# EAGLE design Enclosure 85x58 WS (EAGLE 9.6.2)
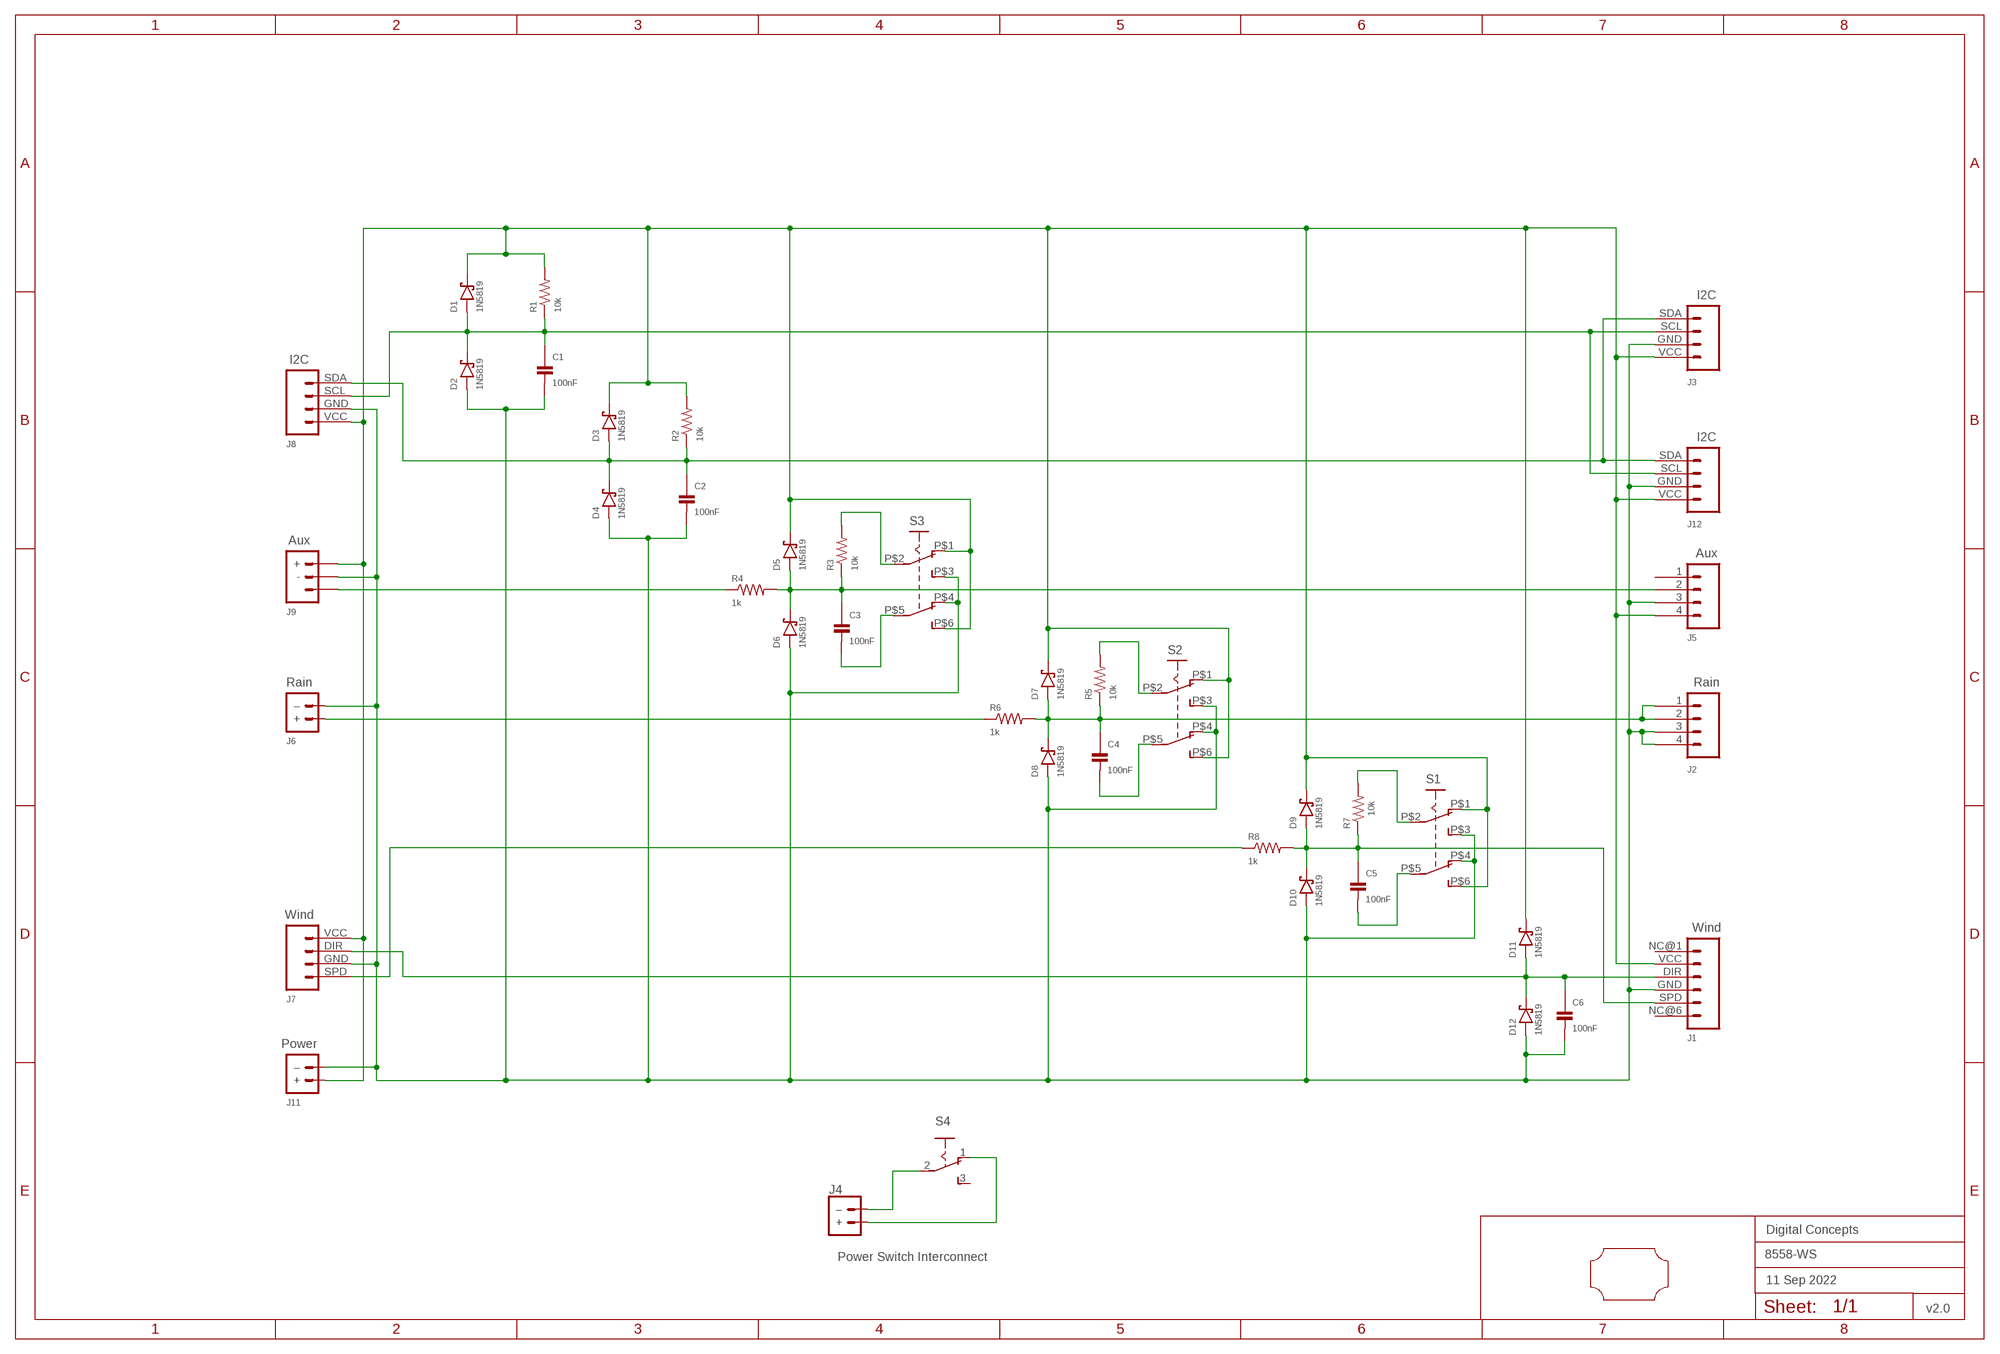
[diagram p0: schematic, sheet 1]
FRAME2 (A3L-LOC): DATE: 11 Sep 2022; OWNER: Digital Concepts; TITLE: 8558-WS; VERSION: v2.0

## Parts
C1  100nF  CAPACITOR-0805-VIA-2  [C0805-VIA-2]
C2  100nF  CAPACITOR-0805-VIA-2  [C0805-VIA-2]
C3  100nF  CAPACITOR-0805  [C0805]
C4  100nF  CAPACITOR-0805  [C0805]
C5  100nF  CAPACITOR-0805  [C0805]
C6  100nF  CAPACITOR-0805-VIA-2  [C0805-VIA-2]
D1  1N5819  DIODE-SCHOTTKY-1N5819  [SOD-123]
D2  1N5819  DIODE-SCHOTTKY-1N5819-VIA-A  [SOD-123-VIA-A]
D3  1N5819  DIODE-SCHOTTKY-1N5819  [SOD-123]
D4  1N5819  DIODE-SCHOTTKY-1N5819-VIA-A  [SOD-123-VIA-A]
D5  1N5819  DIODE-SCHOTTKY-1N5819  [SOD-123]
D6  1N5819  DIODE-SCHOTTKY-1N5819-VIA-A  [SOD-123-VIA-A]
D7  1N5819  DIODE-SCHOTTKY-1N5819  [SOD-123]
D8  1N5819  DIODE-SCHOTTKY-1N5819-VIA-A  [SOD-123-VIA-A]
D9  1N5819  DIODE-SCHOTTKY-1N5819  [SOD-123]
D10  1N5819  DIODE-SCHOTTKY-1N5819-VIA-A  [SOD-123-VIA-A]
D11  1N5819  DIODE-SCHOTTKY-1N5819  [SOD-123]
D12  1N5819  DIODE-SCHOTTKY-1N5819-VIA-A  [SOD-123-VIA-A]
J1  Wind  RJ11-6P6C-VERTICAL-WIND  [RJ11-6-VERTICAL-WIND]
J2  Rain  RJ11-6P4C-VERTICAL  [RJ11-4-VERTICAL]
J3  I2C  RJ11-6P4C-VERTICAL-I2C  [RJ11-4-VERTICAL-I2C]
J4  JST-PH2.0-2-HORIZONTALJST-PTH-2  [JST-PH2.0-2-HORIZONTAL]
J5  Aux  RJ11-6P4C-VERTICAL  [RJ11-4-VERTICAL]
J6  Rain  JST-PH2.0-2-DUALJST-PTH-2  [JST-PH2.0-2-DUAL-POWER]
J7  Wind  JST-PH2.0-4-DUAL-WIND  [JST-PH2.0-4-DUAL-WIND]
J8  I2C  JST-PH2.0-4-DUAL-I2C  [JST-PH2.0-4-DUAL-I2C]
J9  Aux  JST-PH2.0-3-DUAL  [JST-PH2.0-3-DUAL]
J11  Power  JST-PH2.0-2-DUALJST-PTH-2  [JST-PH2.0-2-DUAL-POWER]
J12  I2C  HEADER-1X4-I2C  [CONN_04-I2C]
R1  10k  RESISTOR-VIA-1  [R0805-VIA-1]
R2  10k  RESISTOR-VIA-1  [R0805-VIA-1]
R3  10k  RESISTORR0805  [R0805]
R4  1k  RESISTOR-VIA-1  [R0805-VIA-1]
R5  10k  RESISTORR0805  [R0805]
R6  1k  RESISTOR-VIA-1  [R0805-VIA-1]
R7  10k  RESISTORR0805  [R0805]
R8  1k  RESISTOR-VIA-1  [R0805-VIA-1]
S1  SWITCH-SLIDE-DPDT  [SWITCH-DPDT-SMD]
S2  SWITCH-SLIDE-DPDT  [SWITCH-DPDT-SMD]
S3  SWITCH-SLIDE-DPDT  [SWITCH-DPDT-SMD]
S4  SWITCH-SLIDE-SPDT  [SWITCH-SPDT-PTH]
U$1  PCB-OUTLINE-85X58  [PROTO-28X18-OUTLINE]

## Nets
GND: C1.2 C1.2@VIA C2.2 C2.2@VIA C6.2 C6.2@VIA D2.A D2.P$A(A) D4.A D4.P$A(A) D6.A D6.P$A(A) D8.A D8.P$A(A) D10.A D10.P$A(A) D12.A D12.P$A(A) J1.GND J2.3 J2.4 J3.GND J5.3 J6.-(–) J7.GND J8.GND J9.- J11.-(–) J12.GND S1.P$3(S1) S1.P$4(O2) S2.P$3(S1) S2.P$4(O2) S3.P$3(S1) S3.P$4(O2)
N$1: J6.+ R6.1 R6.1@VIA
N$2: C5.2 S1.P$5(P2)
N$3: R7.2 S1.P$2(P1)
N$4: C6.1 D11.A D12.C J1.DIR J7.DIR
N$5: R5.2 S2.P$2(P1)
N$6: C4.2 S2.P$5(P2)
N$7: C4.1 D7.A D8.C J2.1 J2.2 R5.1 R6.2
N$8: C2.1 D3.A D4.C J3.SDA J8.SDA J12.SDA R2.1 R2.1@VIA
N$9: J9.SIG R4.1 R4.1@VIA
N$10: J7.SPD R8.1 R8.1@VIA
N$11: C1.1 D1.A D2.C J3.SCL J8.SCL J12.SCL R1.1 R1.1@VIA
N$12: R3.2 S3.P$2(P1)
N$13: C3.2 S3.P$5(P2)
N$14: J4.2(–) S4.2(P)
N$15: C3.1 D5.A D6.C J5.2 R3.1 R4.2
N$16: J4.1(+) S4.1(O)
N$29: C5.1 D9.A D10.C J1.SPD R7.1 R8.2
VCC: D1.C D3.C D5.C D7.C D9.C D11.C J1.VCC J3.VCC J5.4 J7.VCC J8.VCC J9.+ J11.+ J12.VCC R1.2 R2.2 S1.P$1(O1) S1.P$6(S2) S2.P$1(O1) S2.P$6(S2) S3.P$1(O1) S3.P$6(S2)
Unconnected: J1.NC@1 J1.NC@6 J5.1 S4.3(S)

## Notes on the sheet
- Power Switch Interconnect

## Library data of the parts
C1 C2 C6 = digitalconcepts:CAPACITOR-0805-VIA-2: 0805 Capacitor with via on Pad 2
C3-C5 = digitalconcepts:CAPACITOR-0805: 0805 Capacitor
D1 D3 D5 D7 D9 D11 = digitalconcepts:DIODE-SCHOTTKY-1N5819: 1N5819 Schottky Diode SOD-123
D2 D4 D6 D8 D10 D12 = digitalconcepts:DIODE-SCHOTTKY-1N5819-VIA-A: 1N5819 Schottky Diode SOD-123 with Cathode Via
J1 = digitalconcepts:RJ11-6P6C-VERTICAL-WIND: RJ11-6P6C-Vertical PCB Socket
J2 J5 = digitalconcepts:RJ11-6P4C-VERTICAL: RJ11-6P4C-Vertical PCB Socket
J3 = digitalconcepts:RJ11-6P4C-VERTICAL-I2C: RJ11-6P4C-Vertical PCB Socket
J4 = digitalconcepts:JST-PH2.0-2-HORIZONTAL: PH2.0 2P Right Angle PCB Connector; PROD_ID: CONN-09863; SKU: PRT-09914
J6 J11 = digitalconcepts:JST-PH2.0-2-DUAL: PH2.0 2P Dual-Side Connector; PROD_ID: CONN-09863; SKU: PRT-09914
J7 = digitalconcepts:JST-PH2.0-4-DUAL-WIND: PH2.0 4P Anemometer Dual Connector
J8 = digitalconcepts:JST-PH2.0-4-DUAL-I2C: PH2.0 4P I2C Dual Connector
J9 = digitalconcepts:JST-PH2.0-3-DUAL: PH2.0 3P Dual Connector
J12 = digitalconcepts:HEADER-1X4-I2C: I2C Interface [Pin 1 Vcc] 4-Pin Header
R1 R2 R4 R6 R8 = digitalconcepts:RESISTOR-VIA-1: Resistor with via on Pad 1
R3 R5 R7 = digitalconcepts:RESISTOR: Resistor; SPICEPREFIX: R
S1-S3 = digitalconcepts:SWITCH-SLIDE-DPDT: Switch SMD DPDT
S4 = digitalconcepts:SWITCH-SLIDE-SPDT: Mini Sliding Switch SPDT
U$1 = digitalconcepts:PCB-OUTLINE-85X58: PCB outline for 85 x 58 enclosure

## Board
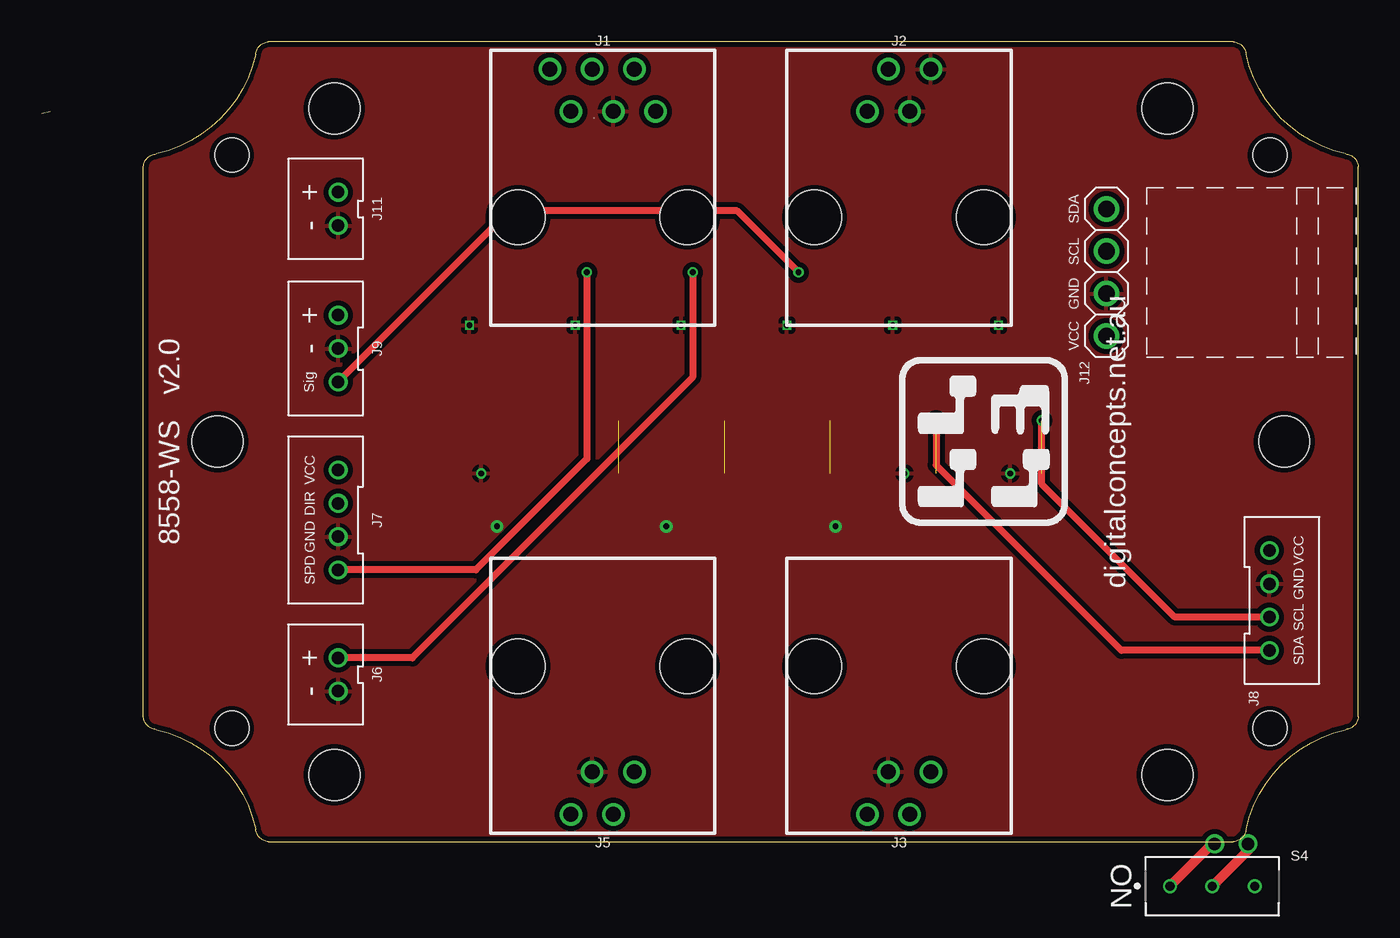
[diagram p1: board, top side]
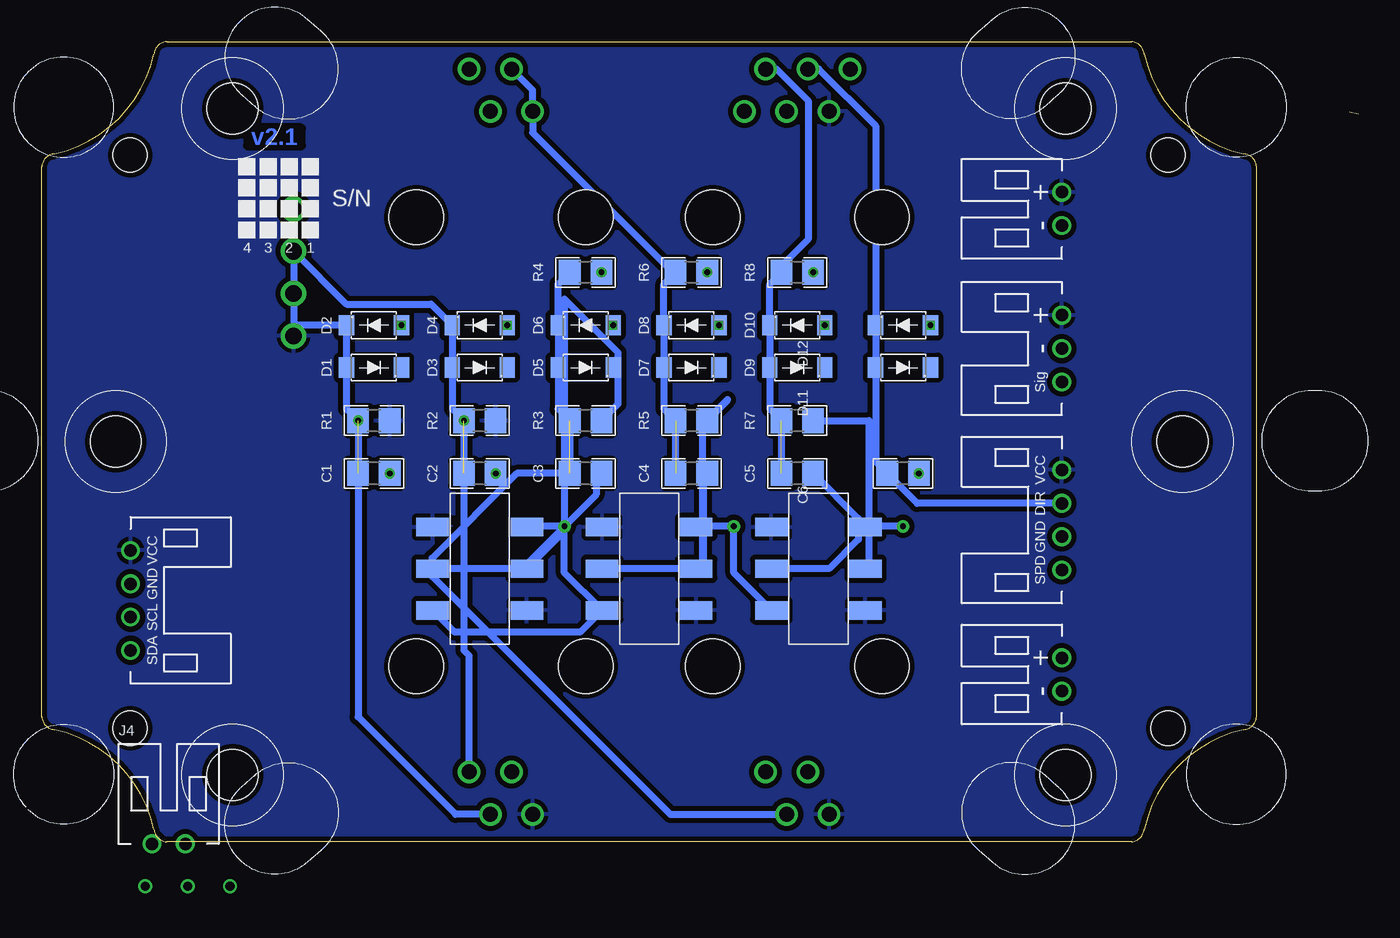
[diagram p2: board, bottom side, seen from below]

Size 79.01 x 48.01 mm. Coordinates in mm from the lower left corner, seen from the top.
Outline: 0.52,43.79 0,43.68
Copper layers (1*16): Top 0.035mm / dielectric 1.5mm / Bottom 0.035mm
Design rules "default *": minimum track width 6mil, minimum drill 0.35mm, track to track 6mil, track to pad 6mil, pad to pad 6mil, via to via 6mil, smd to smd 6mil, copper to edge 6mil, drill to drill 6mil, minimum pad ring 1mil, minimum via ring 8mil, stop-mask expansion 4mil, vias tented up to drill 0mil, thermal gap 10mil

### Footprints (pad centres in the part's own frame; a part is rotated, then mirrored left to right if it is on the bottom)
C0805-VIA-2 = smd 1.3 x 1.5: 1 -0.95,0; 2 0.95,0 | drill 0.35 pad 0.61: 2@VIA 0.95,0
C0805 = smd 1.3 x 1.5: 1 -0.95,0; 2 0.95,0
SOD-123 = smd 0.91 x 1.22: A -1.65,0; C 1.65,0
SOD-123-VIA-A = smd 0.91 x 1.22: A -1.65,0; C 1.65,0 | drill 0.35 square: P$A -1.65,0
RJ11-6-VERTICAL-WIND = drill 0.9: DIR -0.635,7.12; GND 0.635,4.58; NC@1 -3.175,7.12; NC@6 3.175,4.58; SPD 1.905,7.12; VCC -1.905,4.58 | hole 3.25: -5.08,-1.77; 5.08,-1.77
RJ11-4-VERTICAL = drill 0.9: 1 -1.905,4.58; 2 -0.635,7.12; 3 0.635,4.58; 4 1.905,7.12 | hole 3.25: -5.08,-1.77; 5.08,-1.77
RJ11-4-VERTICAL-I2C = drill 0.9: GND 0.635,4.58; SCL -0.635,7.12; SDA -1.905,4.58; VCC 1.905,7.12 | hole 3.25: -5.08,-1.77; 5.08,-1.77
JST-PH2.0-2-HORIZONTAL = drill 0.75: 1 1,0; 2 -1,0
JST-PH2.0-2-DUAL-POWER = drill 0.75: + 1,0; - -1,0
JST-PH2.0-4-DUAL-WIND = drill 0.75: DIR 1,0; GND -1,0; SPD -3,0; VCC 3,0
JST-PH2.0-4-DUAL-I2C = drill 0.75: GND -1,0; SCL 1,0; SDA 3,0; VCC -3,0
JST-PH2.0-3-DUAL = drill 0.75: + 2,0; - 0,0; SIG -2,0
CONN_04-I2C = drill 1 pad 1.524: GND 5.08,0; SCL 2.54,0; SDA 0,0; VCC 7.62,0
R0805-VIA-1 = smd 1.3 x 1.5: 1 -0.95,0; 2 0.95,0 | drill 0.35 pad 0.61: 1@VIA -0.95,0
R0805 = smd 1.3 x 1.5: 1 -0.95,0; 2 0.95,0
SWITCH-DPDT-SMD = smd 1.95 x 1.1: P$1 -2.825,2.5; P$2 -2.825,0; P$3 -2.825,-2.5; P$4 2.825,2.5; P$5 2.825,0; P$6 2.825,-2.5
SWITCH-SPDT-PTH = drill 0.55: 1 -2.54,0; 2 0,0; 3 2.54,0
PROTO-28X18-OUTLINE = hole 2.032: -31.14,17.196; -31.14,-17.196; 31.14,-17.196; 31.14,17.196 | hole 3.048: -24.994,19.99; -32.004,0; -24.994,-19.99; 24.994,-19.99; 32.004,0; 24.994,19.99

### Placement (x,y rotation side)
C1  59.07,22.1 0 bottom
C2  52.72,22.1 0 bottom
C3  46.37,22.1 0 bottom
C4  40.02,22.1 0 bottom
C5  33.67,22.1 0 bottom
C6  27.32,22.1 0 bottom
D1  59.07,28.45 0 bottom
D2  59.07,30.99 180 bottom
D3  52.72,28.45 0 bottom
D4  52.72,30.99 180 bottom
D5  46.37,28.45 0 bottom
D6  46.37,30.99 180 bottom
D7  40.02,28.45 0 bottom
D8  40.02,30.99 180 bottom
D9  33.67,28.45 0 bottom
D10  33.67,30.99 180 bottom
D11  27.32,28.45 0 bottom
D12  27.32,30.99 180 bottom
J1  33.67,39.24 0 top
J2  51.45,39.24 0 top
J3  51.45,8.76 180 top
J4  71.39,-0.13 0 bottom
J5  33.67,8.76 180 top
J6  17.79,10.03 90 bottom
J7  17.79,19.3 90 bottom
J8  73.67,14.48 270 bottom
J9  17.79,29.59 90 bottom
J11  17.79,37.97 90 bottom
J12  63.89,37.97 270 top
R1  59.07,25.27 0 bottom
R2  52.72,25.27 0 bottom
R3  46.37,25.27 0 bottom
R4  46.37,34.16 180 bottom
R5  40.02,25.27 0 bottom
R6  40.02,34.16 180 bottom
R7  33.67,25.27 0 bottom
R8  33.67,34.16 180 bottom
S1  32.4,16.38 180 bottom
S2  42.56,16.38 180 bottom
S3  52.72,16.38 180 bottom
S4  70.24,-2.67 0 top
U$1  42.56,24 0 top

### Tracks (layer width: path | path; a pad name or v marks a point on that pad's centre or on a via)
GND  (via drill 0.35)
  Bottom 0.406: S3.P$3 49.85,18.92 v47.64,18.92 47.64,16.14 S2.P$4 46.69,12.57 54.23,12.57 S3.P$4 | S2.P$3 39.69,18.92 v37.48,18.92 37.48,16.14 S1.P$4 | v27.32,18.92 29.53,18.92 S1.P$3
  pour Top (isolate 0.305): -3.59,54.38 -3.59,-6.41 88.65,-6.41 88.65,54.38
N$1
  Top 0.406: R6.1 39.07,27.86 22.24,11.03 J6.+
N$2
  Bottom 0.406: C5.2 30,19.38 30,18.15 31.76,16.38 S1.P$5
N$3
  Bottom 0.406: R7.2 29.36,25.27 29.36,16.59 S1.P$2
N$4
  Bottom 0.406: J1.DIR 32.37,46.36 28.97,42.96 D12.C D11.A 28.97,22.8 C6.1 26.47,20.3 J7.DIR
N$5
  Bottom 0.406: R5.2 37.85,26.49 37.85,26.55 39.38,25.01 39.38,16.73 S2.P$2
N$6
  Bottom 0.406: C4.2 39.31,21.86 39.31,16.38 S2.P$5
N$7  (1 unrouted)
  Bottom 0.406: C4.1 R5.1 41.67,25.97 D7.A D8.C 41.67,33.46 R6.2 40.97,33.98 49.54,42.55 J2.1 49.54,45.09 J2.2
N$8  (2 unrouted)
  Top 0.406: J8.SDA 64.78,11.48 53.67,22.59 R2.1@VIA
  Bottom 0.406: J3.SDA 53.35,11.17 53.67,11.48 C2.1 R2.1@VIA 54.37,25.97 D3.A D4.C 55.64,32.26 60.72,32.26 63.89,35.43 J12.SDA
N$9
  Top 0.406: R4.1@VIA 41.73,37.85 28.05,37.85 J9.SIG
N$10
  Top 0.406: R8.1@VIA 32.72,22.97 26.05,16.3 J7.SPD
N$11  (2 unrouted)
  Top 0.406: J8.SCL 68,13.48 60.02,21.46 R1.1@VIA
  Bottom 0.406: J12.SCL 63.89,30.99 D2.C D1.A 60.72,25.97 R1.1@VIA C1.1 60.02,7.49 54.17,1.64 J3.SCL
N$12
  Bottom 0.406: R3.2 44.41,26.28 44.41,29.35 47.64,32.57 47.64,18.64 S3.P$2
N$13
  Bottom 0.406: C3.2 45.42,21.78 45.73,21.46 45.73,20.83 50.18,16.38 S3.P$5
N$14
  Top 0.61: S4.2 72.39,-0.52 J4.2
N$15  (1 unrouted)
  Bottom 0.406: R4.2 48.02,33.46 D6.C D5.A 48.02,25.97 R3.1 C3.1 50.49,22.1 55.57,17.02 55.57,15.93 41.29,1.64 J5.2
N$16
  Top 0.61: S4.1 70.24,-0.13 J4.1
N$29  (1 unrouted)
  Bottom 0.406: C5.1 R7.1 35.32,25.97 D9.A D10.C 35.32,33.46 R8.2 34.62,34.54 33.02,36.14 33.02,44.47 34.91,46.36 J1.SPD
VCC
  pour Bottom (isolate 0.305, rank 2): -2.59,53.38 -2.59,-5.41 87.65,-5.41 87.65,53.38

### Text on the board
Bottom: v2.1
tPlace: 8558-WS v2.0 | digitalconcepts.net.au
bPlace: S/N | 1 | 2 | 3 | 4
tNames: SDA | SCL | GND | VCC | ON
bValues: Pull Down | Pull Down | Pull Down | Pull Up | Pull Up | Pull Up